# Altium project CR99102.PrjPCB
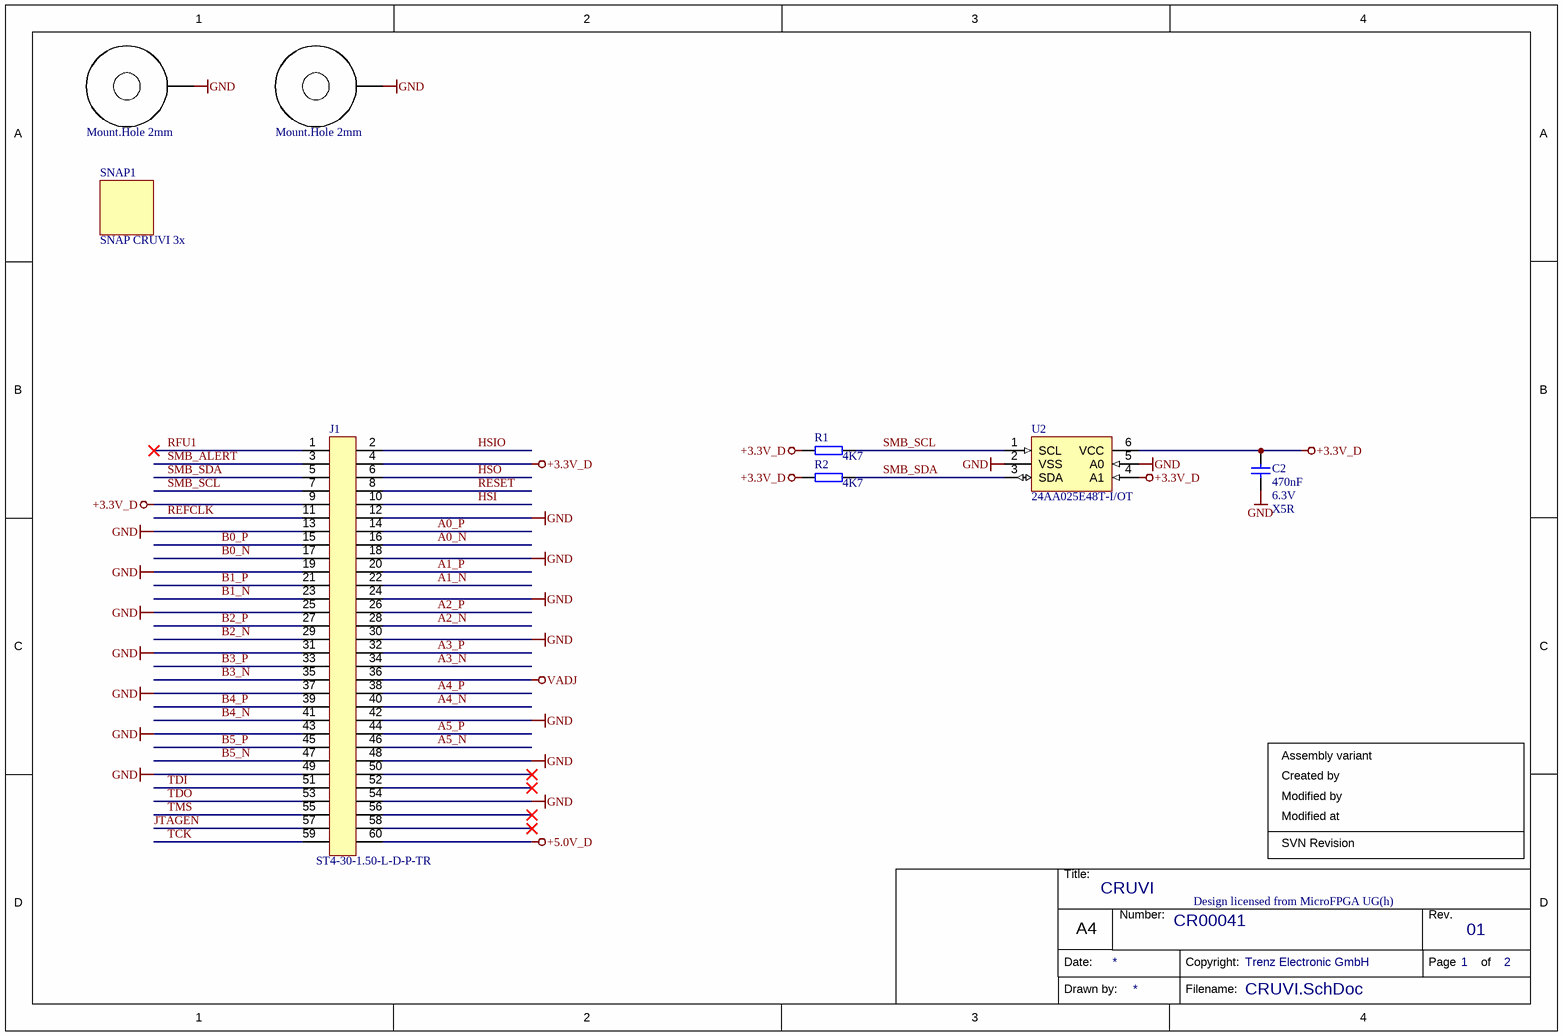
[diagram p0: CRUVI.SchDoc]
Revision: 01; Project: CR99102
1 sheet, 8 parts. Net scope: global (net labels, ports and power ports of the same name join across sheets).
Board file: CR99102.PcbDoc

## Sheet CRUVI.SchDoc: CRUVI
size A4; Organization: Trenz Electronic GmbH; DocumentNumber: CR00041; Revision: 01; SheetNumber: 1; SheetTotal: 2; Date: 2019-11-14; CompanyName: Trenz Electronic GmbH

### Parts
C2  470nF  Voltage: 6.3V  Technology: X5R  [CAPC1005X55N]
H1  Mount.Hole 2mm  [MHole2_2mm]  (no BOM)
H2  Mount.Hole 2mm  [MHole2_2mm]  (no BOM)
J1  ST4-30-1.50-L-D-P-TR  [ST4-30-1_50-L-D]
R1  4K7  [RESC1005X40N]
R2  4K7  [RESC1005X40N]
SNAP1  SNAP CRUVI 3x  [CRUVI_3x_Snap]  (no BOM)
U2  24AA025E48T-I/OT  [SOT95P280X145-6N]

### Nets
+3.3V_D: C2.1 J1.4 J1.9 R1.1 R2.1 U2.4(A1) U2.6(VCC)
+5.0V_D: J1.60
GND: C2.2 H1.1 H2.1 J1.12 J1.13 J1.18 J1.19 J1.24 J1.25 J1.30 J1.31 J1.37 J1.42 J1.43 J1.48 J1.49 J1.54 U2.2(VSS) U2.5(A0)
VADJ: J1.36
A0_N: J1.16
A0_P: J1.14
A1_N: J1.22
A1_P: J1.20
A2_N: J1.28
A2_P: J1.26
A3_N: J1.34
A3_P: J1.32
A4_N: J1.40
A4_P: J1.38
A5_N: J1.46
A5_P: J1.44
B0_N: J1.17
B0_P: J1.15
B1_N: J1.23
B1_P: J1.21
B2_N: J1.29
B2_P: J1.27
B3_N: J1.35
B3_P: J1.33
B4_N: J1.41
B4_P: J1.39
B5_N: J1.47
B5_P: J1.45
HSI: J1.10
HSIO: J1.2
HSO: J1.6
JTAGEN: J1.57
REFCLK: J1.11
RESET: J1.8
RFU1: J1.1
SMB_ALERT: J1.3
SMB_SCL: J1.7 R1.2 U2.1(SCL)
SMB_SDA: J1.5 R2.2 U2.3(SDA)
TCK: J1.59
TDI: J1.51
TDO: J1.53
TMS: J1.55

Not connected (* = marked no-connect by the designer): J1 50* 52* 56* 58*

### Notes on the sheet
- Assembly variant
- Created by
- Modified at
- Modified by
- SVN Revision
- Design licensed from MicroFPGA UG(h)
- Title:
- Number:
- Rev.
- Date:
- A4
- Copyright:
- Page
- of
- Drawn by:
- Filename:

### Library data of the parts
C2 = 23659: KON 470nF 6,3V X5R SMD BF 1005 (0402); AN: 23659; Mixed: SMT; Value: 470n; Preferred: Yes; Temperature-Range: -55/+85; Case: 1005 (0402)
H1 H2 = 27273: AN: 27273; Mixed: THT
J1 = 29686: AN: 29686; Mixed: SMT; Temperature-Range: -55/+125; Case: ST4; HelpURL: b:\AD\adlib\datasheet\Samtec_ST4\; H-ART: ST4-30-1.50-L-D-P-TR
R1 R2 = 22585: WID SMD 4K7 1% 0,063W BF 1005 (0402); AN: 22585; Mixed: SMT; Value: 4.7K; Preferred: Yes; H-ART: RC0402FR-134K7L; Tolerance: 1%; Case: 1005 (0402); Technology: TK100
SNAP1 = 29977: SNAP for CRUVI 3x; AN: 29977
U2 = 26249: AN: 26249; Mixed: SMT; Temperature-Range: -40/+85; Case: SOT23-6; HelpURL: B:\AD\adlib\datasheet\24AA02xExx; H-ART: 24AA025E48T-I/OT

## Assembly variants
1: alternate parts U1 -> 29136
0: not fitted U1